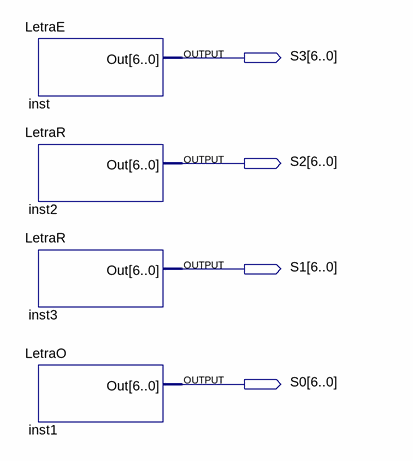
[diagram p0: schematic sheet]
// Quartus schematic ErroC.bdf as structural Verilog: 4 symbols, 4 pins
module ErroC (
  output [6:0] S3,
  output [6:0] S2,
  output [6:0] S1,
  output [6:0] S0
);

  LetraE inst (.Out(S3));
  LetraR inst2 (.Out(S2));
  LetraR inst3 (.Out(S1));
  LetraO inst1 (.Out(S0));
endmodule
